# Altium project Transfer.PrjPcb
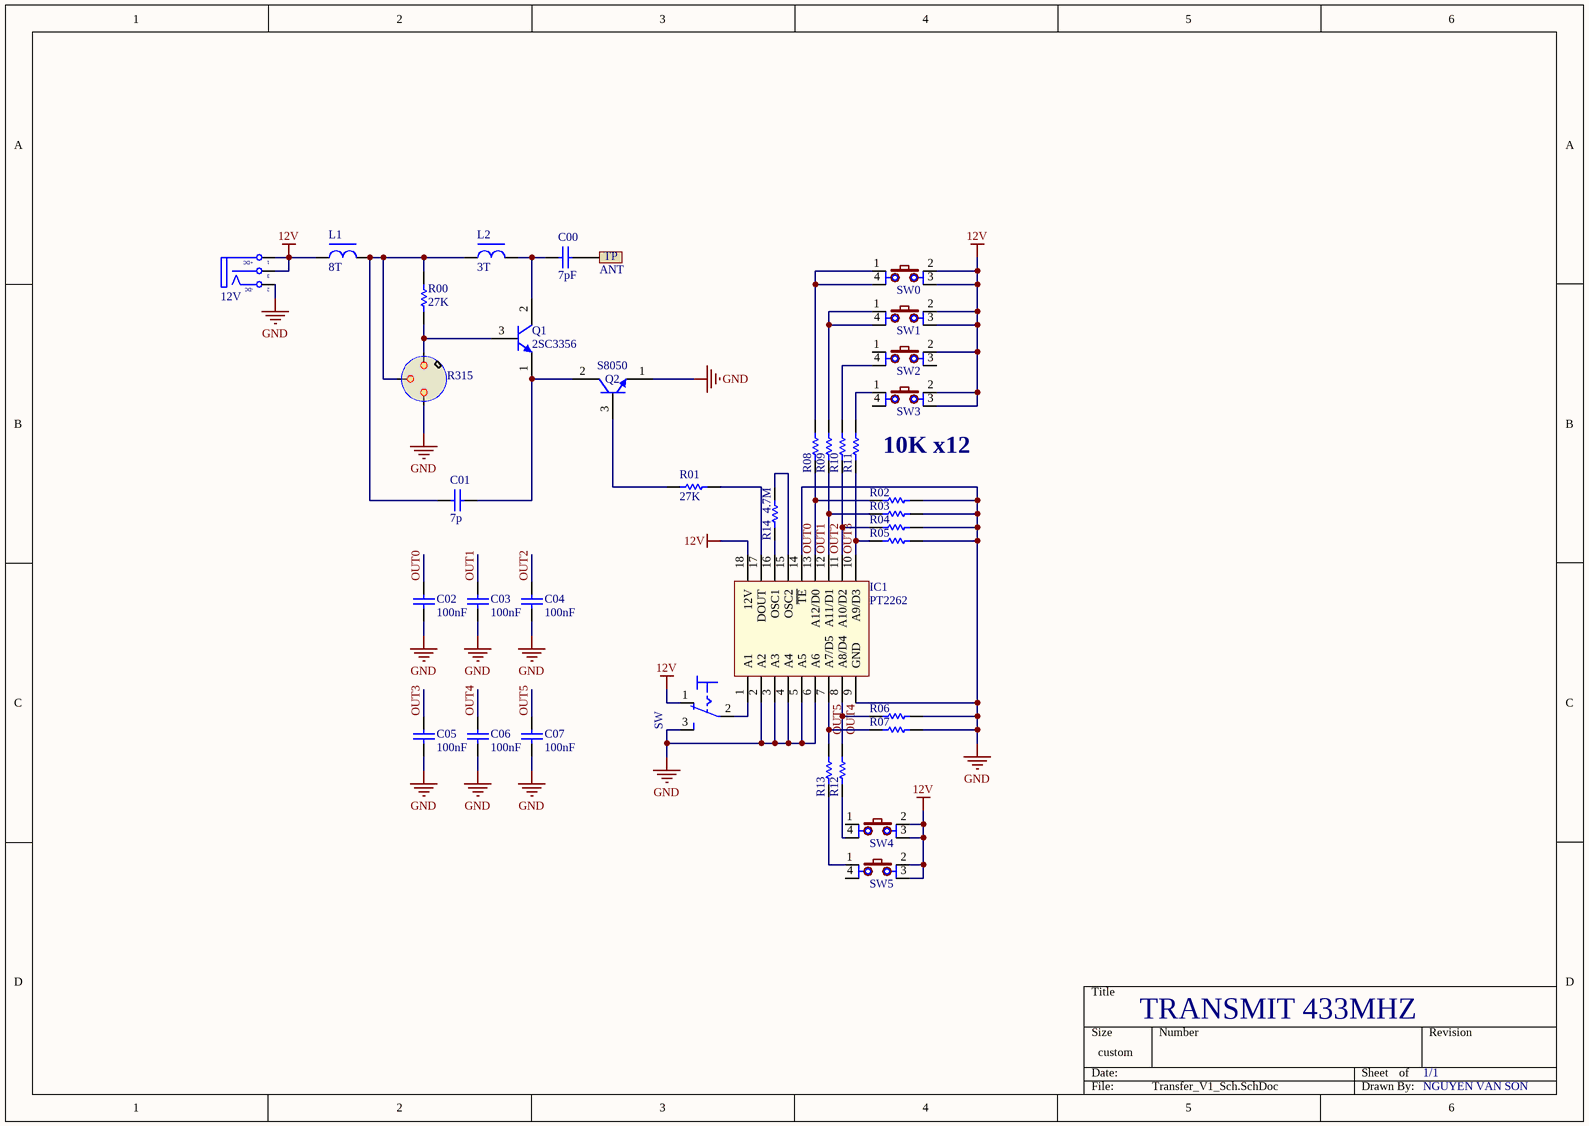
[diagram p0: Transfer_V1_Sch.SchDoc]
1 sheet, 38 parts. Net scope: global (net labels, ports and power ports of the same name join across sheets).
Board file: Transfer_V1_Pcb.PcbDoc

## Sheet Transfer_V1_Sch.SchDoc
size 297 x 209 mm

### Parts
12V  JACK DC 5.5  [JACK DC 5.5]  (value not drawn)
ANT  Test Point  [TP]  (value not drawn)
C00  value 7pF  [CAP-SM-0603]  (hidden comment: Cap Non-Pol SMD)
C01  value 7p  [CAP-SM-0603]  (hidden comment: Cap Non-Pol SMD)
C02  value 100nF  [CAP-SM-0603]  (hidden comment: Cap Non-Pol SMD)
C03  value 100nF  [CAP-SM-0603]  (hidden comment: Cap Non-Pol SMD)
C04  value 100nF  [CAP-SM-0603]  (hidden comment: Cap Non-Pol SMD)
C05  value 100nF  [CAP-SM-0603]  (hidden comment: Cap Non-Pol SMD)
C06  value 100nF  [CAP-SM-0603]  (hidden comment: Cap Non-Pol SMD)
C07  value 100nF  [CAP-SM-0603]  (hidden comment: Cap Non-Pol SMD)
IC1  PT2262  [DIP18]
L1  8T  [L-DIP-M-5.3]
L2  3T  [L-DIP-M-5.3]
Q1  2SC3356  [SOT23B]
Q2  S8050  [SOT23B]
R00  27K  [RES-SM-0603]
R01  27K  [RES-SM-0603]
R02  RESISTOR SMD  [RES-SM-0603]  (value not drawn)
R03  RESISTOR SMD  [RES-SM-0603]  (value not drawn)
R04  RESISTOR SMD  [RES-SM-0603]  (value not drawn)
R05  RESISTOR SMD  [RES-SM-0603]  (value not drawn)
R06  RESISTOR SMD  [RES-SM-0603]  (value not drawn)
R07  RESISTOR SMD  [RES-SM-0603]  (value not drawn)
R08  RESISTOR SMD  [RES-SM-0603]  (value not drawn)
R09  RESISTOR SMD  [RES-SM-0603]  (value not drawn)
R10  RESISTOR SMD  [RES-SM-0603]  (value not drawn)
R11  RESISTOR SMD  [RES-SM-0603]  (value not drawn)
R12  RESISTOR SMD  [RES-SM-0603]  (value not drawn)
R13  RESISTOR SMD  [RES-SM-0603]  (value not drawn)
R14  value 4.7M  [RES-SM-0805]  (hidden comment: RESISTOR SMD)
R315  BXR513A  [BXR315A]  (value not drawn)
SW  MTS-102  [MTS-102]  (value not drawn)
SW0  SW  [SW2-DIP]  (value not drawn)
SW1  SW  [SW2-DIP]  (value not drawn)
SW2  SW  [SW2-DIP]  (value not drawn)
SW3  SW  [SW2-DIP]  (value not drawn)
SW4  SW  [SW2-DIP]  (value not drawn)
SW5  SW  [SW2-DIP]  (value not drawn)

### Nets
12V: 12V.1(T) 12V.3(S) IC1.18(12V) L1.1 SW.1(O) SW0.2 SW0.3 SW1.2 SW1.3 SW2.2 SW3.2 SW3.3 SW4.2 SW4.3 SW5.2 SW5.3
GND: 12V.2(TN) C02.1 C03.1 C04.1 C05.1 C06.1 C07.1 IC1.2(A2) IC1.3(A3) IC1.4(A4) IC1.5(A5) IC1.6(A6) IC1.9(GND) IC1.14(~{TE}) Q2.1(E) R02.1 R03.1 R04.1 R05.1 R06.1 R07.1 R315.3 SW.3(S)
OUT0: C02.2 IC1.13(A12/D0) R02.2 R08.1
OUT1: C03.2 IC1.12(A11/D1) R03.2 R09.1
OUT2: C04.2 IC1.11(A10/D2) R04.2 R10.1
OUT3: C05.2 IC1.10(A9/D3) R05.2 R11.1
OUT4: C06.2 IC1.8(A8/D4) R06.2 R12.1
OUT5: C07.2 IC1.7(A7/D5) R07.2 R13.1
NetANT_TP1: ANT.TP1 C00.1
NetC00_2: C00.2 L2.2 Q1.2(C)
NetC01_1: C01.1 L1.2 L2.1 R00.1 R315.2
NetC01_2: C01.2 Q1.1(E) Q2.2(C)
NetIC1_1: IC1.1(A1) SW.2(P)
NetIC1_15: IC1.15(OSC2) R14.1
NetIC1_16: IC1.16(OSC1) R14.2
NetIC1_17: IC1.17(DOUT) R01.2
NetQ1_3: Q1.3(B) R00.2 R315.1
NetQ2_3: Q2.3(B) R01.1
NetR08_2: R08.2 SW0.1 SW0.4
NetR09_2: R09.2 SW1.1 SW1.4
NetR10_2: R10.2 SW2.4
NetR11_2: R11.2 SW3.1
NetR12_2: R12.2 SW4.4
NetR13_2: R13.2 SW5.1

Not connected (* = marked no-connect by the designer): SW2 1 3; SW3 4; SW4 1; SW5 4

### Notes on the sheet
- 10K x12
- TRANSMIT 433MHZ
- 1/1
- NGUYEN VAN SON
- (in symbol JACK DC 5.5) +DC; -DC
- (in symbol Test Point) TP

### Library data of the parts
12V = JACK DC 5.5: Value: Jac DC
C00 C01 C02 C03 C04 C05 C06 C07 = Cap Non-Pol SMD: Capacitor
IC1 = PT2262: Remote Control Encoder
L1 L2 = L-DIP-1: Inductor; Value: 150 mH
Q1 Q2 = C1815: NPN Bipolar Transistor
R00 R01 R02 R03 R04 R05 R06 R07 R12-R14 = RESISTOR SMD: Resistor
R08 R09-R11 = RESISTOR SMD: Resistor; Value: 2.7K
R315 = BXR315A: Xtal For RF; pin to pad: 1>3 3>1
SW = MTS-102: Rectangular Cable Assemblies .100 Mini Mate Single Row Discrete Wire Cable Assembly, Terminal; MF: Motorola; MP: MTS102; Availability: Unavailable; Value: *; Package: None; SnapEDA_Link: https://www.snapeda.com/parts/MTS102/Motorola/view-part/698799/?ref=snap; Price: None; Check_prices: https://www.snapeda.com/parts/MTS102/Motorola/view-part/698799/?ref=eda
SW0-SW5 = SW4: Switch button 4 pin; Value: Button chip 4 pin